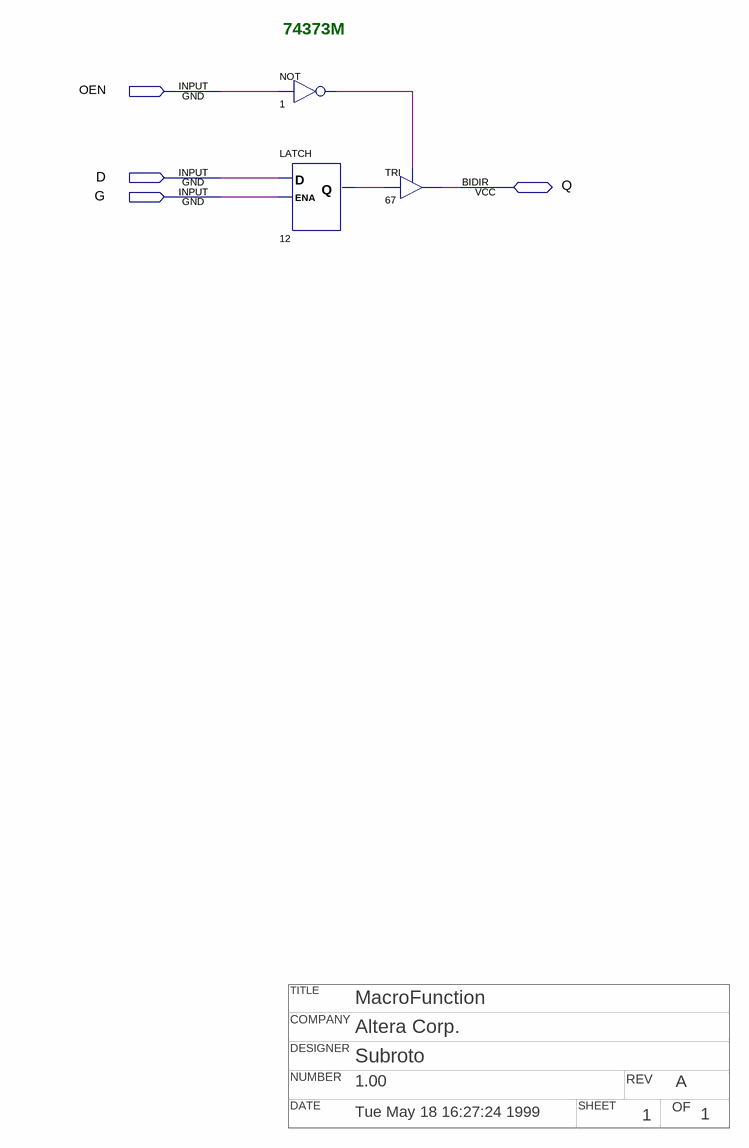
[diagram p0: schematic sheet]
// Quartus schematic 74373m.bdf as structural Verilog: 3 symbols, 4 pins
// Title block: TITLE: MacroFunction; COMPANY: Altera Corp.; DESIGNER: Subroto; NUMBER: 1.00; REV: A; DATE: Tue May 18 16:27:24 1999; SHEET: 1; OF: 1
module \74373m  (
  input  OEN,
  input  D,
  input  G,
  inout  Q
);

  wire n1_out, n12_q;

  not u_1 (n1_out, OEN);
  LATCH u_12 (.D(D), .ENA(G), .Q(n12_q));
  TRI u_67 (.IN(n12_q), .OE(n1_out), .OUT(Q));

  // Notes on the sheet:
  //   74373M
endmodule
